# EAGLE design Bozarth_Trigger (EAGLE 7.6.0)
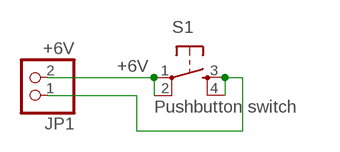
[diagram p0: schematic, sheet 1]

## Parts
JP1  +6V  PINHD-1X2  [1X02]
S1  E-SWITCH_TL1105L-F250-Q  [OMRON_B3F-1XX-JPGMOD]

## Nets
+6V: JP1.2 S1.1(P) S1.2(P1)
N$1: JP1.1 S1.3(S) S1.4(S1)

## Notes on the sheet
- Pushbutton switch

## Library data of the parts
JP1 = pinhead:PINHD-1X2: PIN HEADER
S1 = JPG_16v1:E-SWITCH_TL1105L-F250-Q: PC MOUNT TACTILE MOMENTARY SWITCH (LOW COST, MOUSER)

## Board
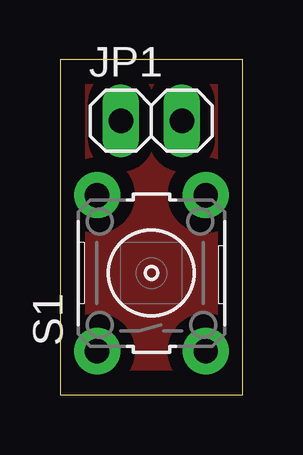
[diagram p1: board, top side]
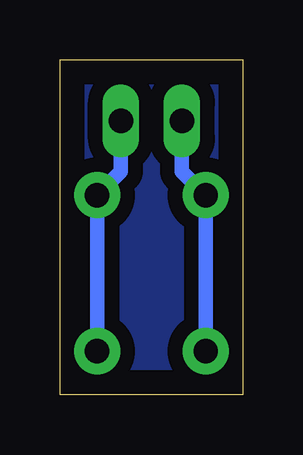
[diagram p2: board, bottom side, seen from below]

Size 7.62 x 13.97 mm. Coordinates in mm from the lower left corner, seen from the top.
Outline: 0,0 7.62,0 7.62,13.97 0,13.97 0,0
Copper layers (1*16): Top 0.035mm / dielectric 1.5mm / Bottom 0.035mm
Design rules "default": minimum track width 10mil, minimum drill 0.6mm, track to track 8mil, track to pad 8mil, pad to pad 8mil, via to via 8mil, smd to smd 8mil, copper to edge 40mil, drill to drill 8mil, minimum pad ring 10mil, minimum via ring 8mil, stop-mask expansion 4mil, vias tented up to drill 0mil, thermal gap 10mil

### Footprints (pad centres in the part's own frame; a part is rotated, then mirrored left to right if it is on the bottom)
1X02 = drill 1.016 long: 1 -1.27,0; 2 1.27,0
OMRON_B3F-1XX-JPGMOD = drill 1.016 pad 1.93: 1 -3.251,-2.261; 2 3.251,-2.261; 3 -3.251,2.261; 4 3.251,2.261

### Placement (x,y rotation side)
JP1  3.81,11.43 0 top
S1  3.81,5.08 90 top

### Tracks (layer width: path | path; a pad name or v marks a point on that pad's centre or on a via)
+6V
  Bottom 0.61: S1.1 S1.2 5.08,9.32 JP1.2
GND
  pour Bottom (isolate 0.61): 0,13.97 7.62,13.97 7.62,0 0,0
  pour Top (isolate 0.61): 0,13.97 7.62,13.97 7.62,0 0,0
N$1
  Bottom 0.61: S1.3 S1.4 2.54,9.32 JP1.1